# EAGLE design BPM7003 LogiStart MegaWing 2.1 (EAGLE 5.10)
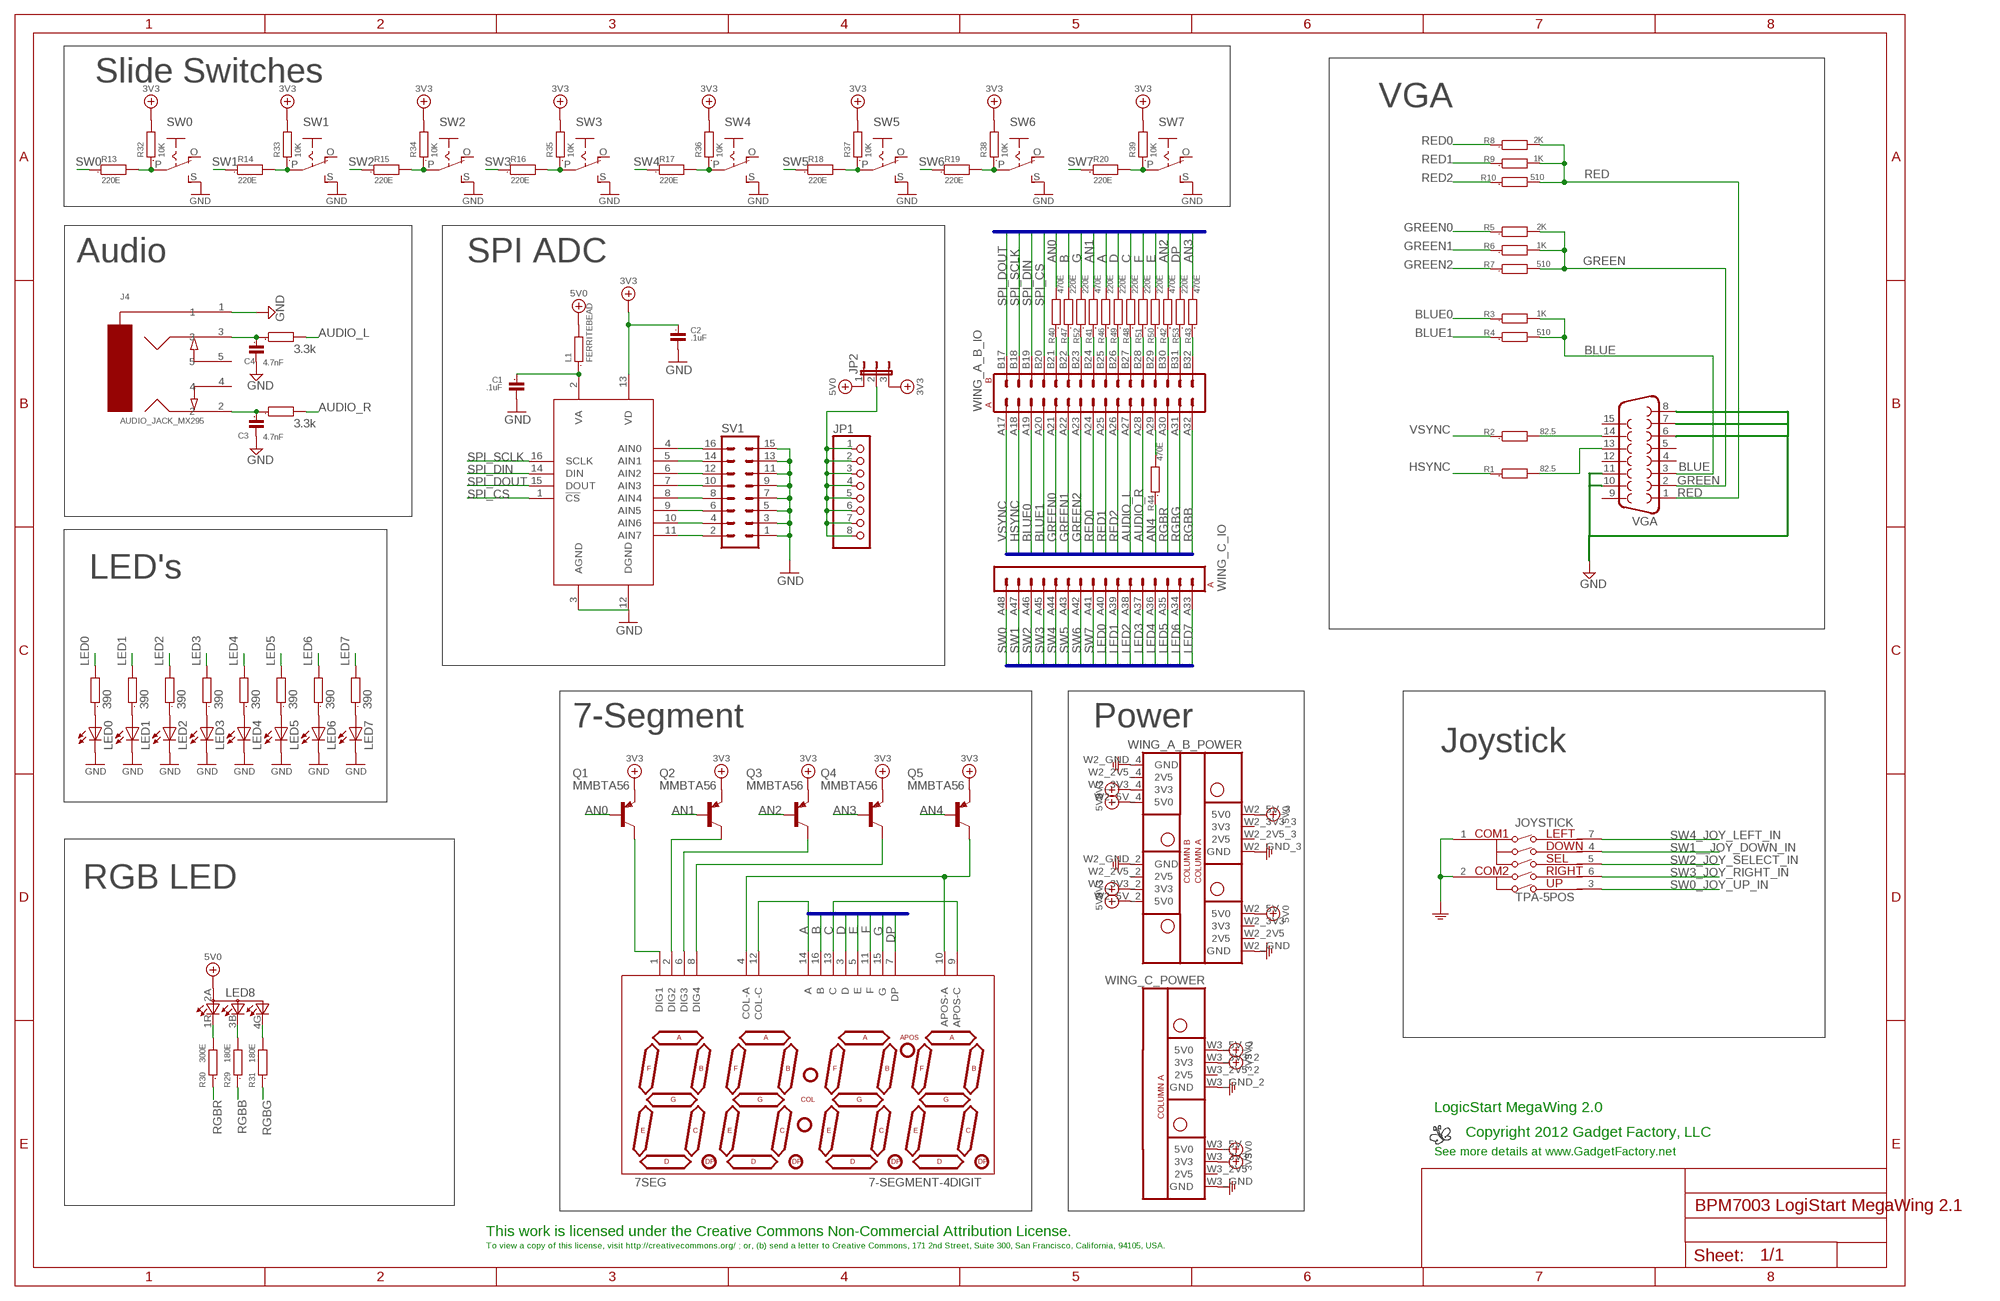
[diagram p0: schematic, sheet 1]

## Parts
7SEG  7-SEGMENT-4DIGIT  [7-SEGMENT-4DIGIT]
C1  .1uF  C0603  [0603]
C2  .1uF  C0603  [0603]
C3  4.7nF  C0603  [0603]
C4  4.7nF  C0603  [0603]
J4  AUDIO_JACK_MX295  [AUDIOJACK_5PIN_MX295]
JOYSTICK  TPA-5POS  [TPA-5POS]
JP1  PINHD-1X8  [1X08]
JP2  JP2E  [JP2]
L1  FERRITEBEAD  R0603  [0603]
LED0  LEDCHIPLED_0805  [CHIPLED_0805]
LED1  LEDCHIPLED_0805  [CHIPLED_0805]
LED2  LEDCHIPLED_0805  [CHIPLED_0805]
LED3  LEDCHIPLED_0805  [CHIPLED_0805]
LED4  LEDCHIPLED_0805  [CHIPLED_0805]
LED5  LEDCHIPLED_0805  [CHIPLED_0805]
LED6  LEDCHIPLED_0805  [CHIPLED_0805]
LED7  LEDCHIPLED_0805  [CHIPLED_0805]
LED8  RBG_LED  [P-LCC-4-3]
LOGO1  BUTTERFLY_LOGO  [BUTTERFLY_LOGO]
Q1  MMBTA56  MMBTA56-SOT23  [SOT23]
Q2  MMBTA56  MMBTA56-SOT23  [SOT23]
Q3  MMBTA56  MMBTA56-SOT23  [SOT23]
Q4  MMBTA56  MMBTA56-SOT23  [SOT23]
Q5  MMBTA56  MMBTA56-SOT23  [SOT23]
R1  82.5  R0603  [0603]
R2  82.5  R0603  [0603]
R3  1K  R0603  [0603]
R4  510  R0603  [0603]
R5  2K  R0603  [0603]
R6  1K  R0603  [0603]
R7  510  R0603  [0603]
R8  2K  R0603  [0603]
R9  1K  R0603  [0603]
R10  510  R0603  [0603]
R11  3.3k  R0603  [0603]
R12  3.3k  R0603  [0603]
R13  220E  R0603  [0603]
R14  220E  R0603  [0603]
R15  220E  R0603  [0603]
R16  220E  R0603  [0603]
R17  220E  R0603  [0603]
R18  220E  R0603  [0603]
R19  220E  R0603  [0603]
R20  220E  R0603  [0603]
R21  390  R0603  [0603]
R22  390  R0603  [0603]
R23  390  R0603  [0603]
R24  390  R0603  [0603]
R25  390  R0603  [0603]
R26  390  R0603  [0603]
R27  390  R0603  [0603]
R28  390  R0603  [0603]
R29  180E  R0603  [0603]
R30  300E  R0603  [0603]
R31  180E  R0603  [0603]
R32  10K  R0603  [0603]
R33  10K  R0603  [0603]
R34  10K  R0603  [0603]
R35  10K  R0603  [0603]
R36  10K  R0603  [0603]
R37  10K  R0603  [0603]
R38  10K  R0603  [0603]
R39  10K  R0603  [0603]
R40  470E  R0603  [0603]
R41  470E  R0603  [0603]
R42  470E  R0603  [0603]
R43  470E  R0603  [0603]
R44  470E  R0603  [0603]
R46  220E  R0603  [0603]
R47  220E  R0603  [0603]
R48  220E  R0603  [0603]
R49  220E  R0603  [0603]
R50  220E  R0603  [0603]
R51  220E  R0603  [0603]
R52  220E  R0603  [0603]
R53  220E  R0603  [0603]
SV1  MA08-2  [MA08-2]
SW0  EG1218S  [EG1218]
SW1  EG1218S  [EG1218]
SW2  EG1218S  [EG1218]
SW3  EG1218S  [EG1218]
SW4  EG1218S  [EG1218]
SW5  EG1218S  [EG1218]
SW6  EG1218S  [EG1218]
SW7  EG1218S  [EG1218]
U1  ADC088S102CIMT  [TSSOP16]
VGA  F15HDH  [HDF15H]
WING_  MEGAWING_FULL_P1MEGAWING_P1  [MEGAWING_FULL_NOHOLES_P1]

## Nets
3V3: C2.1 JP2.3 Q1.2(E) Q2.2(E) Q3.2(E) Q4.2(E) Q5.2(E) R32.2 R33.2 R34.2 R35.2 R36.2 R37.2 R38.2 R39.2 U1.13(VD) WING_.W2_3V3_2(A_B_POWER:3V3) WING_.W2_3V3_4(A_B_POWER:3V3) WING_.W3_3V3(C_POWER:3V3) WING_.W3_3V3_2(C_POWER:3V3)
5V0: JP2.1 L1.2 LED8.2A(A2) WING_.W2_5V(A_B_POWER:5V0) WING_.W2_5V_2(A_B_POWER:5V0) WING_.W2_5V_3(A_B_POWER:5V0) WING_.W2_5V_4(A_B_POWER:5V0) WING_.W3_5V(C_POWER:5V0) WING_.W3_5V_2(C_POWER:5V0)
A: 7SEG.12(COL-C) 7SEG.14(A) R46.2
AIN0: SV1.16 U1.4(AIN0)
AIN1: SV1.14 U1.5(AIN1)
AIN2: SV1.12 U1.6(AIN2)
AIN3: SV1.10 U1.7(AIN3)
AIN4: SV1.8 U1.8(AIN4)
AIN5: SV1.6 U1.9(AIN5)
AIN6: SV1.4 U1.10(AIN6)
AIN7: SV1.2 U1.11(AIN7)
AN0: Q1.1(B) R40.2
AN1: Q2.1(B) R41.2
AN2: Q3.1(B) R42.2
AN3: Q4.1(B) R43.2
AN4: Q5.1(B) R44.1
APOS_A: 7SEG.4(COL-A) 7SEG.10(APOS-A) Q5.3(C)
AUDIO_L: R11.2 WING_.A27(A_B_IO:A11)
AUDIO_R: R12.2 WING_.A28(A_B_IO:A12)
B: 7SEG.16(B) R47.2
BLUE: R3.2 R4.2 VGA.3
BLUE0: R3.1 WING_.A19(A_B_IO:A3)
BLUE1: R4.1 WING_.A20(A_B_IO:A4)
C: 7SEG.9(APOS-C) 7SEG.13(C) R48.2
D: 7SEG.3(D) R49.2
DP: 7SEG.7(DP) R53.2
E: 7SEG.5(E) R50.2
F: 7SEG.11(F) R51.2
G: 7SEG.15(G) R52.2
GND: C1.2 C2.2 C3.2 C4.2 J4.1 JOYSTICK.1(COM1) JOYSTICK.2(COM2) LED0.C LED1.C LED2.C LED3.C LED4.C LED5.C LED6.C LED7.C SV1.1 SV1.3 SV1.5 SV1.7 SV1.9 SV1.11 SV1.13 SV1.15 SW0.S SW1.S SW2.S SW3.S SW4.S SW5.S SW6.S SW7.S U1.3(AGND) U1.12(DGND) VGA.6 VGA.7 VGA.8 VGA.10 VGA.11 WING_.W2_GND(A_B_POWER:GND) WING_.W2_GND_2(A_B_POWER:GND) WING_.W2_GND_3(A_B_POWER:GND) WING_.W2_GND_4(A_B_POWER:GND) WING_.W3_GND(C_POWER:GND) WING_.W3_GND_2(C_POWER:GND) ; supply symbol labelled AGND
GREEN: R5.2 R6.2 R7.2 VGA.2
GREEN0: R5.1 WING_.A21(A_B_IO:A5)
GREEN1: R6.1 WING_.A22(A_B_IO:A6)
GREEN2: R7.1 WING_.A23(A_B_IO:A7)
HSYNC: R1.1 WING_.A18(A_B_IO:A2)
LED0: R21.2 WING_.A40(C_IO:A8)
LED1: R22.2 WING_.A39(C_IO:A7)
LED2: R23.2 WING_.A38(C_IO:A6)
LED3: R24.2 WING_.A37(C_IO:A5)
LED4: R25.2 WING_.A36(C_IO:A4)
LED5: R26.2 WING_.A35(C_IO:A3)
LED6: R27.2 WING_.A34(C_IO:A2)
LED7: R28.2 WING_.A33(C_IO:A1)
LEDB: LED8.3B(CBLUE) R29.2
LEDG: LED8.4G(CGREEN) R31.2
LEDR: LED8.1R(CRED) R30.2
N$1: JP1.1 JP1.2 JP1.3 JP1.4 JP1.5 JP1.6 JP1.7 JP1.8 JP2.2
N$2: C4.1 J4.3 R11.1
N$4: C3.1 J4.2 R12.1
N$6: R41.1 WING_.B24(A_B_IO:B8)
N$13: R42.1 WING_.B30(A_B_IO:B14)
N$17: R1.2 VGA.13
N$18: R2.2 VGA.14
N$19: LED0.A R21.1
N$20: LED1.A R22.1
N$21: LED2.A R23.1
N$22: LED3.A R24.1
N$25: LED4.A R25.1
N$26: LED5.A R26.1
N$27: LED6.A R27.1
N$28: LED7.A R28.1
N$29: 7SEG.1(DIG1) Q1.3(C)
N$30: 7SEG.2(DIG2) Q2.3(C)
N$31: 7SEG.6(DIG3) Q3.3(C)
N$32: 7SEG.8(DIG4) Q4.3(C)
N$37: C1.1 L1.1 U1.2(VA)
N$40: R43.1 WING_.B32(A_B_IO:B16)
N$41: R44.2 WING_.A29(A_B_IO:A13)
N$42: R40.1 WING_.B21(A_B_IO:B5)
RED: R8.2 R9.2 R10.2 VGA.1
RED0: R8.1 WING_.A24(A_B_IO:A8)
RED1: R9.1 WING_.A25(A_B_IO:A9)
RED2: R10.1 WING_.A26(A_B_IO:A10)
RGBB: R29.1 WING_.A32(A_B_IO:A16)
RGBG: R31.1 WING_.A31(A_B_IO:A15)
RGBR: R30.1 WING_.A30(A_B_IO:A14)
SEGA: R46.1 WING_.B25(A_B_IO:B9)
SEGB: R47.1 WING_.B22(A_B_IO:B6)
SEGC: R48.1 WING_.B27(A_B_IO:B11)
SEGD: R49.1 WING_.B26(A_B_IO:B10)
SEGDP: R53.1 WING_.B31(A_B_IO:B15)
SEGE: R50.1 WING_.B29(A_B_IO:B13)
SEGF: R51.1 WING_.B28(A_B_IO:B12)
SEGG: R52.1 WING_.B23(A_B_IO:B7)
SPI_CS: U1.1(!CS) WING_.B20(A_B_IO:B4)
SPI_DIN: U1.14(DIN) WING_.B19(A_B_IO:B3)
SPI_DOUT: U1.15(DOUT) WING_.B17(A_B_IO:B1)
SPI_SCLK: U1.16(SCLK) WING_.B18(A_B_IO:B2)
SW0: R13.1 WING_.A48(C_IO:A16)
SW0_JOY_UP_IN: JOYSTICK.3(UP) R13.2 R32.1 SW0.P
SW1: R14.1 WING_.A47(C_IO:A15)
SW1__JOY_DOWN_IN: JOYSTICK.4(DOWN) R14.2 R33.1 SW1.P
SW2: R15.1 WING_.A46(C_IO:A14)
SW2_JOY_SELECT_IN: JOYSTICK.5(SELECT) R15.2 R34.1 SW2.P
SW3: R16.1 WING_.A45(C_IO:A13)
SW3_JOY_RIGHT_IN: JOYSTICK.6(RIGHT) R16.2 R35.1 SW3.P
SW4: R17.1 WING_.A44(C_IO:A12)
SW4_JOY_LEFT_IN: JOYSTICK.7(LEFT) R17.2 R36.1 SW4.P
SW5: R18.1 WING_.A43(C_IO:A11)
SW5_IN: R18.2 R37.1 SW5.P
SW6: R19.1 WING_.A42(C_IO:A10)
SW6_IN: R19.2 R38.1 SW6.P
SW7: R20.1 WING_.A41(C_IO:A9)
SW7_IN: R20.2 R39.1 SW7.P
VSYNC: R2.1 WING_.A17(A_B_IO:A1)
Unconnected: J4.4 J4.5 SW0.O SW1.O SW2.O SW3.O SW4.O SW5.O SW6.O SW7.O VGA.4 VGA.5 VGA.9 VGA.12 VGA.15 WING_.W2_2V5(A_B_POWER:2V5) WING_.W2_2V5_2(A_B_POWER:2V5) WING_.W2_2V5_3(A_B_POWER:2V5) WING_.W2_2V5_4(A_B_POWER:2V5) WING_.W2_3V3(A_B_POWER:3V3) WING_.W2_3V3_3(A_B_POWER:3V3) WING_.W3_2V5(C_POWER:2V5) WING_.W3_2V5_2(C_POWER:2V5)

## Buses
A,B,C,D,E,F,G,DP,COL_A,COL_C,APOS_A,APOS_C
SW[0..7],LED[0..7]
RED[0..2],GREEN[0..2],BLUE[0..1],VERTICAL_SYNC,HORIZONTAL_SYNC,AUDIO,SPI_SCLK,SPI_DIN,SPI_DOUT,SPI_CS,JOY_SELECT,JOY_RIGHT,JOY_LEFT,JOY_DOWN,JOY_UP,AN[0..3],A,B,C,D,E,F,G,DP

## Notes on the sheet
- Slide Switches
- VGA
- Audio | SPI ADC
- LED's
- 7-Segment | Power
- Joystick
- RGB LED
- LogicStart MegaWing 2.0
- Copyright 2012 Gadget Factory, LLC
- See more details at www.GadgetFactory.net
- This work is licensed under the Creative Commons Non-Commercial Attribution License.
- To view a copy of this license, visit http://creativecommons.org/ ; or, (b) send a letter to Creative Commons, 171 2nd Street, Suite 300, San Francisco, California, 94105, USA.

## Library data of the parts
7SEG = GadgetFactory_Pub_1_0:7-SEGMENT-4DIGIT: This is a part for the 4-Digit 7-segment LEDs from Young Sun. Different from the Digikey LEDs, all 16 pins are used. The LONGPADS Variant is used for a test jig, but you may like it because there is more pad to solder to. If you are concerned about routing space, the standard works just fine though.
C1-C4 = GadgetFactory:C: CAPACITOR, European symbol
J4 = GadgetFactory:AUDIO_JACK_MX295
JOYSTICK = proxmark:TPA-5POS: Navigation switch, 4 directions with select Digikey part: 401-1130-1-ND
JP1 = GadgetFactory_all:PINHD-1X8: PIN HEADER
JP2 = GadgetFactory_lib:JP2E: JUMPER
L1 R1-R44 R46-R53 = GadgetFactory:R: RESISTOR, European symbol
LED0 LED1-LED7 = led:LED: LED OSRAM: - CHIPLED LG R971, LG N971, LY N971, LG Q971, LY Q971, LO R971, LY R971 LH N974, LH R974 LS Q976, LO Q976, LY Q976 LO Q996 - Hyper CHIPLED LW Q18S LB Q993, LB Q99A, LB R99A - SideLED LS A670, LO A670, LY A670, LG A670, LP A670 LB A673, LV A673, LT A673, LW A673 LH A674 LY A675 LS A676, LA A676, LO A676, LY A676, LW A676 LS A679, LY A679, LG A679 - Hyper Micro SIDELED® LS Y876, LA Y876, LO Y876, LY Y876 LT Y87S - SmartLED LW L88C, LW L88S LB L89C, LB L89S, LG L890 LS L89K, LO L89K, LY L89K LS L896, LA L896, LO L896, LY L896 - TOPLED LS T670, LO T670, LY T670, LG T670, LP T670 LSG T670, LSP T670, LSY T670, LOP T670, LYG T670 LG T671, LOG T671, LSG T671 LB T673, LV T673, LT T673, LW T673 LH T674 LS T676, LA T676, LO T676, LY T676, LB T676, LH T676, LSB T676, LW T676 LB T67C, LV T67C, LT T67C, LS T67K, LO T67K, LY T67K, LW E67C LS E67B, LA E67B, LO E67B, LY E67B, LB E67C, LV E67C, LT E67C LW T67C LS T679, LY T679, LG T679 LS T770, LO T770, LY T770, LG T770, LP T770 LB T773, LV T773, LT T773, LW T773 LH T774 LS E675, LA E675, LY E675, LS T675 LS T776, LA T776, LO T776, LY T776, LB T776 LHGB T686 LT T68C, LB T68C - Hyper Mini TOPLED® LB M676 - Mini TOPLED Santana® LG M470 LS M47K, LO M47K, LY M47K Source: http://www.osram.convergy.de LUXEON: - LUMILED® LXK2-PW12-R00, LXK2-PW12-S00, LXK2-PW14-U00, LXK2-PW14-V00 LXK2-PM12-R00, LXK2-PM12-S00, LXK2-PM14-U00 LXK2-PE12-Q00, LXK2-PE12-R00, LXK2-PE12-S00, LXK2-PE14-T00, LXK2-PE14-U00 LXK2-PB12-K00, LXK2-PB12-L00, LXK2-PB12-M00, LXK2-PB14-N00, LXK2-PB14-P00, LXK2-PB14-Q00 LXK2-PR12-L00, LXK2-PR12-M00, LXK2-PR14-Q00, LXK2-PR14-R00 LXK2-PD12-Q00, LXK2-PD12-R00, LXK2-PD12-S00 LXK2-PH12-R00, LXK2-PH12-S00 LXK2-PL12-P00, LXK2-PL12-Q00, LXK2-PL12-R00 Source: www.luxeon.com KINGBRIGHT: KA-3528ASYC Source: www.kingbright.com
LED8 = GadgetFactory_Pub_1_0:RBG_LED: OSRAM - Hyper Multi TOPLED® (RGB) LB E673, LV E673, LT E673 - Power TOPLED® Enhanced optical Power LED (HOP2000) LS E67B, LA E67B, LO E67B, LY E67B - Hyper Multi TOPLED® Enhanced optical Power LED (HOP2000 / ATON®) LATB T66B - Hyper Multi TOPLED® Hyper-Bright LED LATB T686 Source: http://www.osram.convergy.de/
LOGO1 = GadgetFactory_Pub:BUTTERFLY_LOGO
Q1-Q5 = transistor-pnp:*-?: PNP Transistor
SV1 = GadgetFactory_lib:MA08-2: PIN HEADER
SW0 SW1-SW7 = adafruit:EG1218: SLIDING SWITCH 0.1" spacing through hole, vertical SPDT slide switch http://www.ladyada.net/library/pcb/eaglelibrary.html
U1 = spiadc:ADC088S102
VGA = GadgetFactory:F15: SUB-D; OC_FARNELL: unknown; OC_NEWARK: unknown
WING_ = Papilio:MEGAWING_FULL_P1

## Board
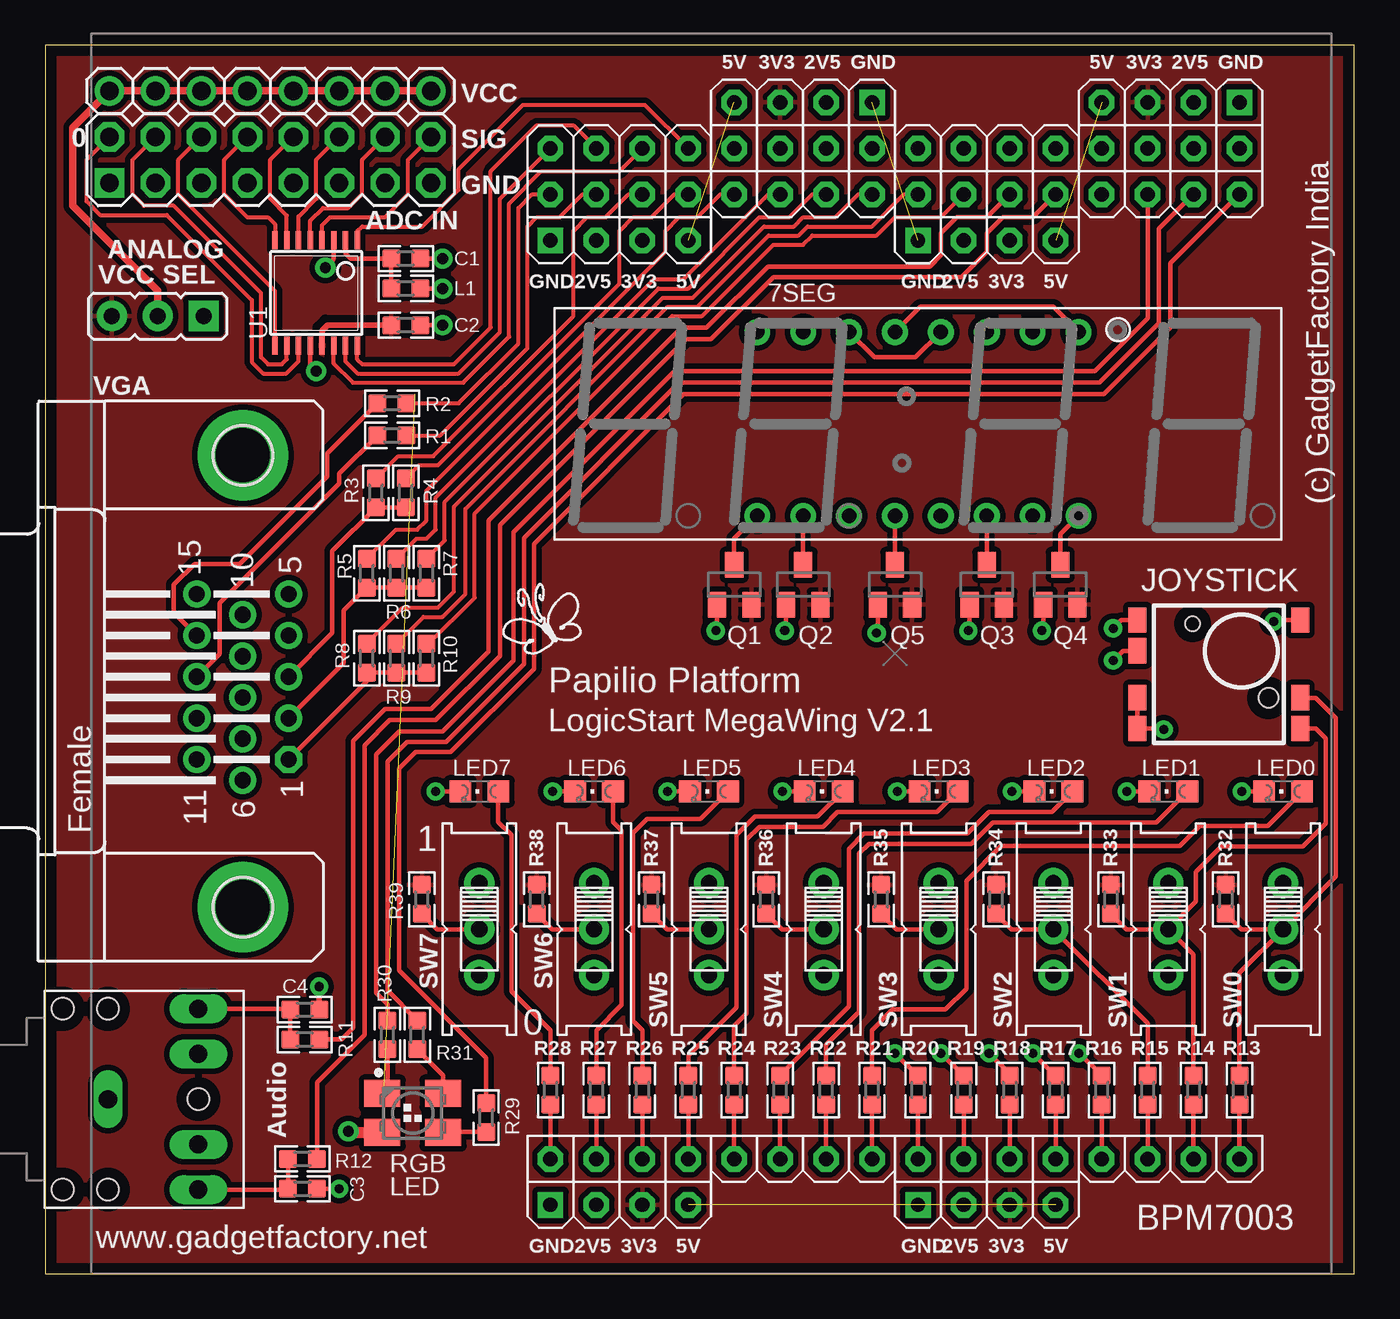
[diagram p1: board, top side]
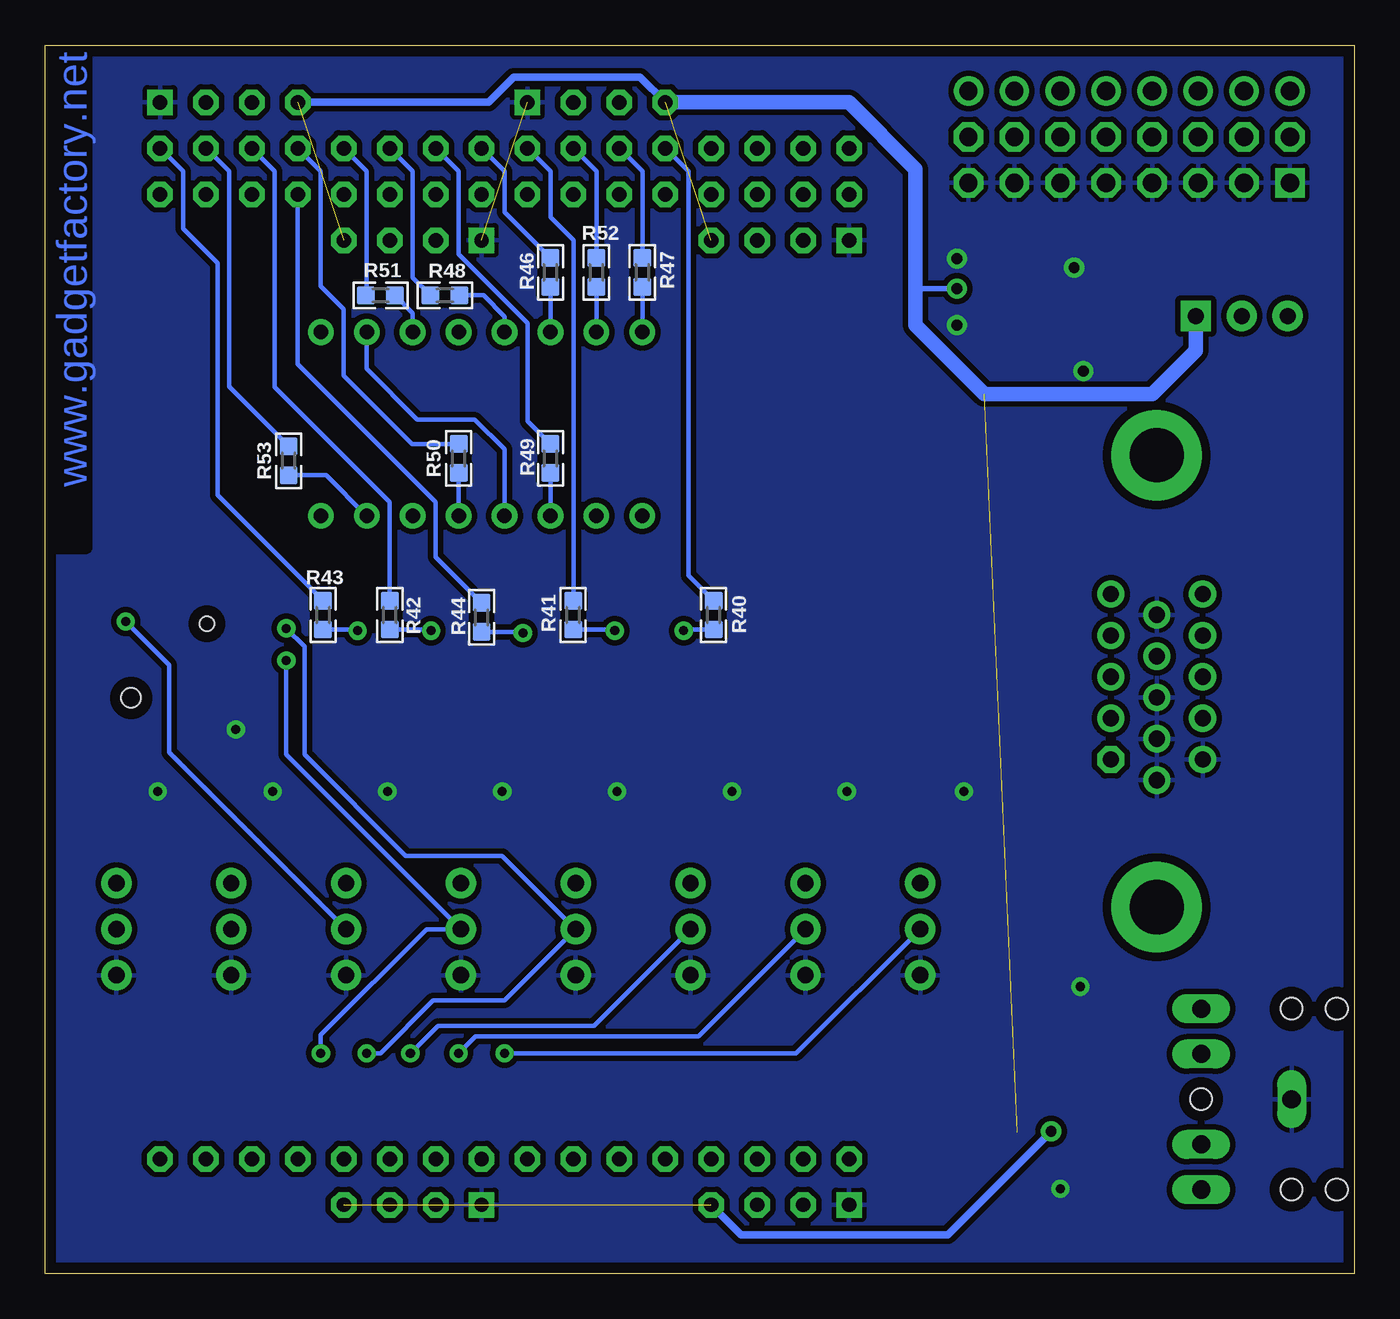
[diagram p2: board, bottom side, seen from below]

Size 72.39 x 67.94 mm. Coordinates in mm from the lower left corner, seen from the top.
Outline: 0,0 72.39,0 72.39,67.94 0,67.94 0,0
Copper layers (1*16): Top 0.035mm / dielectric 1.5mm / Bottom 0.035mm
Design rules "SparkFun_Derived_GoldePheonix_7mil *": minimum track width 9mil, minimum drill 19mil, track to track 11mil, track to pad 11mil, pad to pad 11mil, via to via 11mil, smd to smd 4mil, copper to edge 24mil, drill to drill 10mil, minimum pad ring 12mil, minimum via ring 10mil, stop-mask expansion 4mil, vias tented up to drill 24mil, thermal gap 10mil
tRestrict: 4 lines

### Footprints (pad centres in the part's own frame; a part is rotated, then mirrored left to right if it is on the bottom)
7-SEGMENT-4DIGIT = drill 0.8 pad 1.422 round: 1 -8.89,-5.08; 2 -6.35,-5.08; 3 -3.81,-5.08; 4 -1.27,-5.08; 5 1.27,-5.08; 6 3.81,-5.08; 7 6.35,-5.08; 8 8.89,-5.08; 9 8.89,5.08; 10 6.35,5.08; 11 3.81,5.08; 12 1.27,5.08; 13 -1.27,5.08; 14 -3.81,5.08; 15 -6.35,5.08; 16 -8.89,5.08
0603 = smd 1 x 1: 1 -0.8,0; 2 0.8,0
AUDIOJACK_5PIN_MX295 = drill 1 long: 1 0,2.5; 2 -5,-2.5; 3 5,-2.5; 4 -2.5,-2.5; 5 2.5,-2.5 | hole 1.2: -5,2.5; 5,2.5; -5,5; 5,5; 0,-2.5
TPA-5POS = smd 1 x 1.4: 1 -4.5,-3; 2 -4.5,-1.3; 3 4.5,-1.3; 4 4.5,-3; 5 4.5,3; 6 -4.5,1.3; 7 -4.5,3 | hole 0.8: -1.45,2.8 | hole 1.1: 2.75,-1.3
1X08 = drill 1.016 round: 1 -8.89,0; 2 -6.35,0; 3 -3.81,0; 4 -1.27,0; 5 1.27,0; 6 3.81,0; 7 6.35,0; 8 8.89,0
JP2 = drill 0.9 pad 1.676 square: 1 -2.54,0 | drill 0.9 pad 1.676 round: 2 0,0; 3 2.54,0
CHIPLED_0805 = smd 1.2 x 1.2: A 0,-1.05; C 0,1.05
P-LCC-4-3 = smd 1.5 x 2: 1R -1.077,-1.681; 2A 1.077,-1.681; 3B 1.077,1.681; 4G -1.077,1.681
SOT23 = smd 1 x 1.4: 1 -0.95,-1.1; 2 0.95,-1.1; 3 0,1.1
MA08-2 = drill 1.016 square: 1 -8.89,-1.27 | drill 1.016 octagon: 2 -8.89,1.27; 3 -6.35,-1.27; 4 -6.35,1.27; 5 -3.81,-1.27; 6 -3.81,1.27; 7 -1.27,-1.27; 8 -1.27,1.27; 9 1.27,-1.27; 10 1.27,1.27; 11 3.81,-1.27; 12 3.81,1.27; 13 6.35,-1.27; 14 6.35,1.27; 15 8.89,-1.27; 16 8.89,1.27
EG1218 = drill 0.9 pad 1.676 round: O -2.54,0; P 0,0; S 2.54,0
TSSOP16 = smd 0.305 x 0.991: 1 -2.275,-2.918; 2 -1.625,-2.918; 3 -0.975,-2.918; 4 -0.325,-2.918; 5 0.325,-2.918; 6 0.975,-2.918; 7 1.625,-2.918; 8 2.275,-2.918; 9 2.275,2.918; 10 1.625,2.918; 11 0.975,2.918; 12 0.325,2.918; 13 -0.325,2.918; 14 -0.975,2.918; 15 -1.625,2.918; 16 -2.275,2.918
HDF15H = drill 0.9 octagon: 1 4.329,2.54 | drill 0.9 round: 2 2.043,2.54; 3 -0.243,2.54; 4 -2.529,2.54; 5 -4.815,2.54; 6 5.472,0; 7 3.186,0; 8 0.9,0; 9 -1.386,0; 10 -3.672,0; 11 4.329,-2.54; 12 2.043,-2.54; 13 -0.243,-2.54; 14 -2.529,-2.54; 15 -4.815,-2.54 | drill 3 pad 5 round: P$1 -12.5,0; P$2 12.5,0
MEGAWING_FULL_NOHOLES_P1 = drill 0.8 octagon: A17 59.69,43.18; A18 59.69,40.64; A19 59.69,38.1; A20 59.69,35.56; A21 59.69,33.02; A22 59.69,30.48; A23 59.69,27.94; A24 59.69,25.4; A25 59.69,22.86; A26 59.69,20.32; A27 59.69,17.78; A28 59.69,15.24; A29 59.69,12.7; A30 59.69,10.16; A31 59.69,7.62; A32 59.69,5.08; A33 6.35,43.18; A34 6.35,40.64; A35 6.35,38.1; A36 6.35,35.56; A37 6.35,33.02; A38 6.35,30.48; A39 6.35,27.94; A40 6.35,25.4; A41 6.35,22.86; A42 6.35,20.32; A43 6.35,17.78; A44 6.35,15.24; A45 6.35,12.7; A46 6.35,10.16; A47 6.35,7.62; A48 6.35,5.08; B17 62.23,43.18; B18 62.23,40.64; B19 62.23,38.1; B20 62.23,35.56; B21 62.23,33.02; B22 62.23,30.48; B23 62.23,27.94; B24 62.23,25.4; B25 62.23,22.86; B26 62.23,20.32; B27 62.23,17.78; B28 62.23,15.24; B29 62.23,12.7; B30 62.23,10.16; B31 62.23,7.62; B32 62.23,5.08; W2_2V5 57.15,40.64; W2_2V5_2 64.77,27.94; W2_2V5_3 57.15,20.32; W2_2V5_4 64.77,7.62; W2_3V3 57.15,38.1; W2_3V3_2 64.77,30.48; W2_3V3_3 57.15,17.78; W2_3V3_4 64.77,10.16; W2_5V 57.15,35.56; W2_5V_2 64.77,33.02; W2_5V_3 57.15,15.24; W2_5V_4 64.77,12.7; W3_2V5 3.81,40.64; W3_2V5_2 3.81,20.32; W3_3V3 3.81,38.1; W3_3V3_2 3.81,17.78; W3_5V 3.81,35.56; W3_5V_2 3.81,15.24 | drill 0.8 square: W2_GND 57.15,43.18; W2_GND_2 64.77,25.4; W2_GND_3 57.15,22.86; W2_GND_4 64.77,5.08; W3_GND 3.81,43.18; W3_GND_2 3.81,22.86

### Placement (x,y rotation side)
7SEG  48.26,46.99 0 top
C1  19.94,56.13 0 top
C2  19.94,52.45 0 top
C3  14.22,4.7 0 top
C4  14.35,14.61 0 top
J4  5.97,9.65 90 top
JOYSTICK  64.9,33.15 0 top
JP1  12.45,65.41 0 top
JP2  6.22,52.96 180 top
L1  19.94,54.48 0 top
LED0  68.45,26.67 90 top
LED1  62.1,26.67 90 top
LED2  55.75,26.67 90 top
LED3  49.4,26.67 90 top
LED4  43.05,26.67 90 top
LED5  36.7,26.67 90 top
LED6  30.35,26.67 90 top
LED7  24,26.67 90 top
LED8  20.32,8.89 270 top
LOGO1  27.56,35.69 0 top
Q1  38.1,38.1 0 top
Q2  41.91,38.1 0 top
Q3  52.07,38.1 0 top
Q4  56.13,38.1 0 top
Q5  46.99,38.1 0 top
R1  19.18,46.35 180 top
R2  19.18,48.13 180 top
R3  18.29,43.18 270 top
R4  19.94,43.18 270 top
R5  17.78,38.73 270 top
R6  19.43,38.73 270 top
R7  21.08,38.73 270 top
R8  17.78,34.04 270 top
R9  19.43,34.04 270 top
R10  21.08,34.04 270 top
R11  14.35,12.95 0 top
R12  14.22,6.35 0 top
R13  66.04,10.16 90 top
R14  63.5,10.16 90 top
R15  60.96,10.16 90 top
R16  58.42,10.16 90 top
R17  55.88,10.16 90 top
R18  53.34,10.16 90 top
R19  50.8,10.16 90 top
R20  48.26,10.16 90 top
R21  45.72,10.16 270 top
R22  43.18,10.16 270 top
R23  40.64,10.16 270 top
R24  38.1,10.16 270 top
R25  35.56,10.16 270 top
R26  33.02,10.16 270 top
R27  30.48,10.16 270 top
R28  27.94,10.16 270 top
R29  24.38,8.64 270 top
R30  18.92,13.21 270 top
R31  20.57,13.21 270 top
R32  65.28,20.7 90 top
R33  58.93,20.7 90 top
R34  52.58,20.7 90 top
R35  46.23,20.7 90 top
R36  39.88,20.7 90 top
R37  33.53,20.7 90 top
R38  27.18,20.7 90 top
R39  20.83,20.7 90 top
R40  35.43,36.42 270 bottom
R41  43.2,36.42 270 bottom
R42  53.34,36.42 270 bottom
R43  57.02,36.42 270 bottom
R44  48.26,36.3 90 bottom
R46  44.45,55.37 270 bottom
R47  39.37,55.37 270 bottom
R48  50.29,54.1 0 bottom
R49  44.45,45.09 270 bottom
R50  49.53,45.09 270 bottom
R51  53.85,54.1 0 bottom
R52  41.91,55.37 270 bottom
R53  58.93,44.96 270 bottom
SV1  12.45,61.59 0 top
SW0  68.45,19.05 270 top
SW1  62.1,19.05 270 top
SW2  55.75,19.05 270 top
SW3  49.4,19.05 270 top
SW4  43.05,19.05 270 top
SW5  36.7,19.05 270 top
SW6  30.35,19.05 270 top
SW7  24,19.05 270 top
U1  14.99,54.23 180 top
VGA  10.92,32.77 270 top
WING_  71.12,0 90 top

### Tracks (layer width: path | path; a pad name or v marks a point on that pad's centre or on a via)
3V3
  Top 0.305: C2.1 15.62,52.45 15.31,52.14 U1.13
  pour Top (isolate 0.305): 0,67.94 0,0 72.39,0 72.39,67.94
5V0  (via drill 0.6)  (4 unrouted)
  Top 0.254: v21.97,54.48 L1.2
  Top 0.61: v16.76,7.87 16.82,7.81 LED8.2A
  Bottom 0.305: 24.26,54.48 v21.97,54.48
  Bottom 0.406: WING_.W2_5V_4 47.88,64.77 46.48,66.17 39.5,66.17 WING_.W2_5V_2 | WING_.W3_5V 33.91,2.16 22.48,2.16 v16.76,7.87
  Bottom 0.813: WING_.W2_5V_2 27.94,64.77 24.26,61.09 24.26,54.48 24.26,52.45 20.45,48.64 11.18,48.64 8.76,51.05 JP2.1
A
  Top 0.254: 7SEG.14 45.85,50.67 48.13,50.67 7SEG.12
  Bottom 0.254: 7SEG.14 R46.2
AIN0
  Top 0.229: U1.4 15.31,57.98 15.75,58.42 18.8,58.42 20.07,59.69 20.07,61.59 SV1.16
AIN1
  Top 0.229: U1.5 14.66,58.22 15.37,58.93 16.76,58.93 17.53,59.69 17.53,61.59 SV1.14
AIN2
  Top 0.229: U1.6 14.01,58.46 14.99,59.44 14.99,61.59 SV1.12
AIN3
  Top 0.229: U1.7 13.36,58.52 12.45,59.44 12.45,61.59 SV1.10
AIN4
  Top 0.229: U1.8 12.71,58.03 12.32,58.42 11.18,58.42 9.91,59.69 9.91,61.59 SV1.8
AIN5
  Top 0.229: U1.9 12.71,54.34 7.37,59.69 7.37,61.59 SV1.6
AIN6
  Top 0.229: U1.10 13.36,50.57 13.08,50.29 12.32,50.29 11.94,50.67 11.94,54.23 7.11,59.05 5.46,59.05 4.83,59.69 4.83,61.59 SV1.4
AIN7
  Top 0.229: U1.11 14.01,50.46 13.34,49.78 12.06,49.78 11.43,50.42 11.43,53.85 6.73,58.55 3.05,58.55 2.29,59.31 2.29,61.59 SV1.2
AN0  (via drill 0.5)
  Top 0.254: v37.08,35.56 37.15,35.63 Q1.1
  Bottom 0.254: R40.2 37.02,35.62 v37.08,35.56
AN1  (via drill 0.5)
  Top 0.254: v40.89,35.56 40.96,35.63 Q2.1
  Bottom 0.254: R41.2 40.96,35.62 v40.89,35.56
AN2  (via drill 0.5)
  Top 0.254: v51.05,35.56 51.12,35.63 Q3.1
  Bottom 0.254: R42.2 51.12,35.62 v51.05,35.56
AN3  (via drill 0.5)
  Top 0.254: v55.12,35.56 55.18,35.63 Q4.1
  Bottom 0.254: R43.2 55.18,35.62 v55.12,35.56
AN4  (via drill 0.5)
  Top 0.254: Q5.1 46.04,35.5 v45.97,35.43
  Bottom 0.254: R44.1 46.04,35.5 v45.97,35.43
APOS_A
  Top 0.254: Q5.3 7SEG.4
  Bottom 0.254: 7SEG.4 46.99,45.59 48.64,47.24 51.82,47.24 54.61,50.04 7SEG.10
AUDIO_L
  Top 0.254: WING_.A27 52.07,58.42 50.42,58.42 49.53,57.53 49.53,56.31 48.92,55.7 39.95,55.7 36.58,52.32 35.18,52.32 24.51,41.66 24.51,34.42 21.34,31.24 18.8,31.24 17.02,29.46 17.02,13.59 16.38,12.95 R11.2
AUDIO_R
  Top 0.254: WING_.A28 54.61,58.42 52.96,58.42 52.07,57.53 52.07,56.52 50.67,55.12 40.26,55.12 36.83,51.69 35.43,51.69 25.15,41.4 25.15,34.16 21.59,30.61 19.05,30.61 17.65,29.21 17.65,13.21 15.02,10.58 R12.2
B
  Bottom 0.254: 7SEG.16 R47.2
BLUE
  Top 0.254: R4.2 R3.2 15.88,39.97 15.88,35.42 VGA.3
BLUE0
  Top 0.229: WING_.A19 32.26,59.69 30.99,58.42 29.97,58.42 29.21,57.66 29.21,52.96 21.46,45.21 19.52,45.21 R3.1
BLUE1
  Top 0.229: WING_.A20 34.8,59.69 33.53,58.42 32.51,58.42 31.75,57.66 31.75,54.74 21.72,44.7 20.66,44.7 R4.1
C
  Top 0.254: 7SEG.9 55.75,53.47 48.39,53.47 7SEG.13
  Bottom 0.254: R48.2 48.16,54.1 46.99,52.93 7SEG.13
D
  Bottom 0.254: 7SEG.3 R49.2
DP
  Bottom 0.254: R53.2 56.86,44.16 7SEG.7
E
  Bottom 0.254: 7SEG.5 R50.2
F
  Bottom 0.254: 7SEG.11 52.07,53.12 R51.2
G
  Bottom 0.254: 7SEG.15 R52.2
GND  (via drill 0.5, 0.6)  (1 unrouted)
  Top 0.254: LED1.C 60.83,26.67 v59.82,26.67 | LED2.C 54.48,26.67 v53.47,26.67 | C3.2 v16.26,4.7 | v47.12,26.67 LED3.C | LED4.C v40.77,26.67 | v34.42,26.67 LED5.C | U1.12 14.66,50.24 v14.99,49.91 | U1.3 15.96,56.09 v15.49,55.63 | C2.2 v21.97,52.45 | C1.2 v21.97,56.13 | LED6.C v28.07,26.67 | LED0.C v66.17,26.67 | v21.59,26.67 LED7.C | JOYSTICK.2 JOYSTICK.1 61.8,30.15 v61.85,30.1
  Top 0.305: C4.2 | C4.2 v15.15,15.88
  pour Bottom (isolate 0.305): 0,67.94 0,0 72.39,0 72.39,67.94
GREEN
  Top 0.254: R7.2 R6.2 R5.2 16.51,36.66 16.51,33.77 VGA.2
GREEN0
  Top 0.229: WING_.A21 37.34,59.69 36.07,58.42 35.05,58.42 34.29,57.66 34.29,56.52 21.08,43.31 21.08,41.66 20.57,41.15 19.39,41.15 R5.1
GREEN1
  Top 0.229: WING_.A22 40.01,59.69 35.31,54.99 33.66,54.99 21.59,42.93 21.59,41.15 21.08,40.64 20.54,40.64 R6.1
GREEN2
  Top 0.229: WING_.A23 42.42,59.69 41.15,58.42 39.5,58.42 35.56,54.48 33.91,54.48 22.1,42.67 22.1,40.55 R7.1
HSYNC
  Top 0.229: WING_.A18 29.72,59.69 28.45,58.42 27.18,58.42 26.67,57.91 26.67,51.18 21.84,46.35 R1.1
LED0
  Top 0.254: WING_.A40 R21.2
LED1
  Top 0.254: WING_.A39 R22.2
LED2
  Top 0.254: WING_.A38 R23.2
LED3
  Top 0.254: WING_.A37 R24.2
LED4
  Top 0.254: WING_.A36 R25.2
LED5
  Top 0.254: WING_.A35 R26.2
LED6
  Top 0.254: WING_.A34 R27.2
LED7
  Top 0.254: WING_.A33 R28.2
LEDB
  Top 0.254: R29.2 22.02,7.84 LED8.3B
LEDG
  Top 0.254: LED8.4G 22,10.98 R31.2
LEDR
  Top 0.254: R30.2 18.92,10.25 LED8.1R
N$1
  Top 0.406: JP1.8 JP1.7 JP1.6 JP1.5 JP1.4 JP1.3 JP1.2 JP1.1 1.52,63.37 1.52,59.05 6.22,54.36 JP2.2
N$2
  Top 0.254: J4.3 13.5,14.65 C4.1 R11.1
N$4
  Top 0.254: R12.1 C3.1 13.38,4.65 J4.2
N$6
  Bottom 0.254: WING_.B24 44.45,60.96 44.45,58.42 43.18,57.15 43.18,37.24 R41.1
N$13
  Bottom 0.254: WING_.B30 59.69,60.96 59.69,49.02 53.34,42.67 R42.1
N$17
  Top 0.254: VGA.13 9.65,34.28 9.65,37.08 16.26,43.69 16.26,44.23 R1.2
N$18
  Top 0.254: VGA.14 7.11,36.56 7.11,38.1 8.26,39.24 10.76,39.24 15.58,44.07 15.58,45.34 R2.2
N$19
  Top 0.254: R21.1 45.72,13.46 46.86,14.61 49.78,14.61 50.93,15.75 50.93,21.72 52.86,23.65 62.74,23.65 63.86,24.77 67.6,24.77 LED0.A
N$20
  Top 0.254: LED1.A 61.45,24.97 52.4,24.97 51.21,23.77 45.54,23.77 45.01,23.24 45.01,14.48 43.18,12.65 R22.1
N$21
  Top 0.254: LED2.A 55.66,25.53 52.2,25.53 51,24.33 45.29,24.33 44.45,23.5 44.45,14.77 R23.1
N$22
  Top 0.254: R24.1 38.1,13.72 38.79,14.4 38.79,24 39.5,24.71 43,24.71 43.81,25.53 49.31,25.53 LED3.A
N$25
  Top 0.254: R25.1 35.56,12.06 38.23,14.73 38.23,24.26 39.24,25.27 42.71,25.27 LED4.A
N$26
  Top 0.254: R26.1 33.02,13.46 32.51,13.97 32.51,24.38 33.27,25.15 36.23,25.15 LED5.A
N$27
  Top 0.254: R27.1 30.48,13.46 31.88,14.86 31.88,24.51 31.4,24.98 LED6.A
N$28
  Top 0.254: R28.1 27.94,13.46 25.78,15.62 25.78,24.26 25.05,24.98 LED7.A
N$29
  Top 0.254: Q1.3 38.1,40.64 7SEG.1
N$30
  Top 0.254: Q2.3 7SEG.2
N$31
  Top 0.254: Q3.3 7SEG.6
N$32
  Top 0.254: Q4.3 56.13,40.89 7SEG.8
N$37
  Top 0.254: U1.2 16.61,56.41 16.89,56.13 C1.1 L1.1
N$40
  Bottom 0.254: R43.1 62.87,43.06 62.87,55.88 64.77,57.78 64.77,60.96 WING_.B32
N$41
  Bottom 0.254: R44.2 50.8,39.64 50.8,42.67 58.42,50.29 WING_.A29
N$42
  Bottom 0.254: WING_.B21 36.83,60.96 36.83,38.62 R40.1
RED
  Top 0.254: R10.2 R9.2 R8.2 17.78,32.76 VGA.1
RED0
  Top 0.229: WING_.A24 44.96,59.69 43.69,58.42 41.91,58.42 41.4,57.91 39.75,57.91 35.81,53.98 34.16,53.98 22.61,42.42 22.61,37.72 21.72,36.83 19.77,36.83 R8.1
RED1
  Top 0.229: WING_.A25 47.5,59.69 45.72,57.91 42.16,57.91 41.66,57.4 40.01,57.4 36.07,53.47 34.42,53.47 23.24,42.29 23.24,37.59 21.97,36.32 20.92,36.32 R9.1
RED2
  Top 0.229: WING_.A26 49.53,58.42 46.99,58.42 45.97,57.4 42.42,57.4 41.91,56.9 40.26,56.9 36.32,52.96 34.67,52.96 23.75,42.04 23.75,37.38 21.21,34.84 R10.1
RGBB
  Top 0.254: WING_.A32 62.23,55.88 62.23,52.32 58.55,48.64 35.31,48.64 27.03,40.36 27.03,33.45 22.43,28.85 20.47,28.85 19.56,27.94 19.56,16.76 24.38,11.94 R29.1
RGBG
  Top 0.254: WING_.A31 61.59,57.78 61.59,52.58 58.29,49.28 35.05,49.28 26.47,40.69 26.47,33.71 22.17,29.41 20.02,29.41 18.92,28.32 18.92,15.66 R31.1
RGBR
  Top 0.254: WING_.A30 60.96,52.83 58.04,49.91 34.8,49.91 25.91,41.02 25.91,33.91 21.97,29.97 19.56,29.97 18.29,28.7 18.29,15.53 18.92,14.9 R30.1
SEGA
  Bottom 0.254: R46.1 46.99,58.71 46.99,60.96 WING_.B25
SEGB
  Bottom 0.254: R47.1 39.37,60.96 WING_.B22
SEGC
  Bottom 0.254: WING_.B27 52.07,60.96 52.07,55.08 R48.1
SEGD
  Bottom 0.254: WING_.B26 49.53,60.96 49.53,56.39 45.72,52.58 45.72,47.16 R49.1
SEGDP
  Bottom 0.254: WING_.B31 62.23,60.96 62.23,50.55 62.23,49.06 R53.1
SEGE
  Bottom 0.254: WING_.B29 57.15,60.96 57.15,54.61 55.88,53.34 55.88,49.66 52.11,45.88 R50.1
SEGF
  Bottom 0.254: WING_.B28 54.61,60.96 54.61,54.14 R51.1
SEGG
  Bottom 0.254: R52.1 41.91,60.96 WING_.B23
SPI_CS
  Top 0.229: WING_.B20 33.15,64.64 26.42,64.64 22.86,61.09 22.86,59.94 20.83,57.91 17.53,57.91 17.26,57.65 U1.1
SPI_DIN
  Top 0.229: WING_.B19 31.75,60.96 27.43,60.96 25.65,59.18 25.65,51.82 23.11,49.28 17.02,49.28 15.96,50.33 U1.14
SPI_DOUT
  Top 0.229: WING_.B17 25.15,59.44 25.15,52.07 22.86,49.78 17.27,49.78 16.61,50.45 U1.15
SPI_SCLK
  Top 0.229: WING_.B18 29.21,63.5 27.18,63.5 24.64,60.96 24.64,52.32 22.61,50.29 17.53,50.29 17.26,50.56 U1.16
SW0
  Top 0.254: WING_.A48 R13.1
SW0_JOY_UP_IN
  Top 0.254: R13.2 66.04,16.64 SW0.P | SW0.P 71.37,21.97 71.37,30.73 70.26,31.85 JOYSTICK.3 | SW0.P 66.13,19.05 R32.1
SW1
  Top 0.254: WING_.A47 R14.1
SW1__JOY_DOWN_IN
  Top 0.254: R14.2 63.5,17.65 SW1.P | SW1.P 63.63,20.57 63.63,22.23 65.02,23.62 69.55,23.62 70.81,24.89 70.81,29.59 70.26,30.15 JOYSTICK.4 | SW1.P 59.78,19.05 R33.1
SW2
  Top 0.254: WING_.A46 R15.1
SW2_JOY_SELECT_IN  (via drill 0.5)
  Top 0.254: R15.2 60.96,13.84 SW2.P 53.43,19.05 R34.1 | JOYSTICK.5 68.02,36.15 v67.94,36.07
  Bottom 0.254: v67.94,36.07 65.53,33.66 65.53,28.83 SW2.P
SW3
  Top 0.254: WING_.A45 R16.1
SW3_JOY_RIGHT_IN  (via drill 0.5)
  Top 0.254: R16.2 57.19,12.19 v57.15,12.19 | JOYSTICK.6 59.59,34.45 v59.05,33.91 | SW3.P 47.08,19.05 R35.1
  Bottom 0.254: v59.05,33.91 59.05,28.7 SW3.P 51.31,19.05 57.15,13.21 v57.15,12.19
SW4
  Top 0.254: WING_.A44 R17.1
SW4_JOY_LEFT_IN  (via drill 0.5)
  Top 0.254: R17.2 55.84,10.96 v54.61,12.19 | JOYSTICK.7 59.52,36.15 v59.05,35.69 | SW4.P 40.73,19.05 R36.1
  Bottom 0.254: v59.05,35.69 58.04,34.67 58.04,28.7 52.45,23.11 47.12,23.11 SW4.P 46.99,15.11 50.93,15.11 53.85,12.19 v54.61,12.19
SW5
  Top 0.254: WING_.A43 R18.1
SW5_IN  (via drill 0.5)
  Top 0.254: R18.2 53.34,11.05 v52.2,12.19 | SW5.P 34.38,19.05 R37.1
  Bottom 0.254: SW5.P 42.04,13.72 50.67,13.72 v52.2,12.19
SW6
  Top 0.254: WING_.A42 R19.1
SW6_IN  (via drill 0.5)
  Top 0.254: R19.2 50.76,10.96 v49.53,12.19 | SW6.P 28.03,19.05 R38.1
  Bottom 0.254: SW6.P 36.27,13.13 48.59,13.13 v49.53,12.19
SW7
  Top 0.254: WING_.A41 R20.1
SW7_IN  (via drill 0.5)
  Top 0.254: R20.2 48.22,10.96 v46.99,12.19 | SW7.P 21.68,19.05 R39.1
  Bottom 0.254: SW7.P 30.86,12.19 v46.99,12.19
VSYNC
  Top 0.229: WING_.A17 26.92,59.69 26.16,58.93 26.16,51.44 22.86,48.13 R2.1

### Text on the board
Bottom: www.gadgetfactory.net
tPlace: VCC | 0 | SIG | GND | ADC IN | ANALOG | VCC SEL | VGA | (c) GadgetFactory India | Papilio Platform | LogicStart MegaWing V2.1 | 1 | 0 | Audio | RGB | LED | BPM7003 | www.gadgetfactory.net